# Altium schematic sheet 子图2.SchDoc
size A4
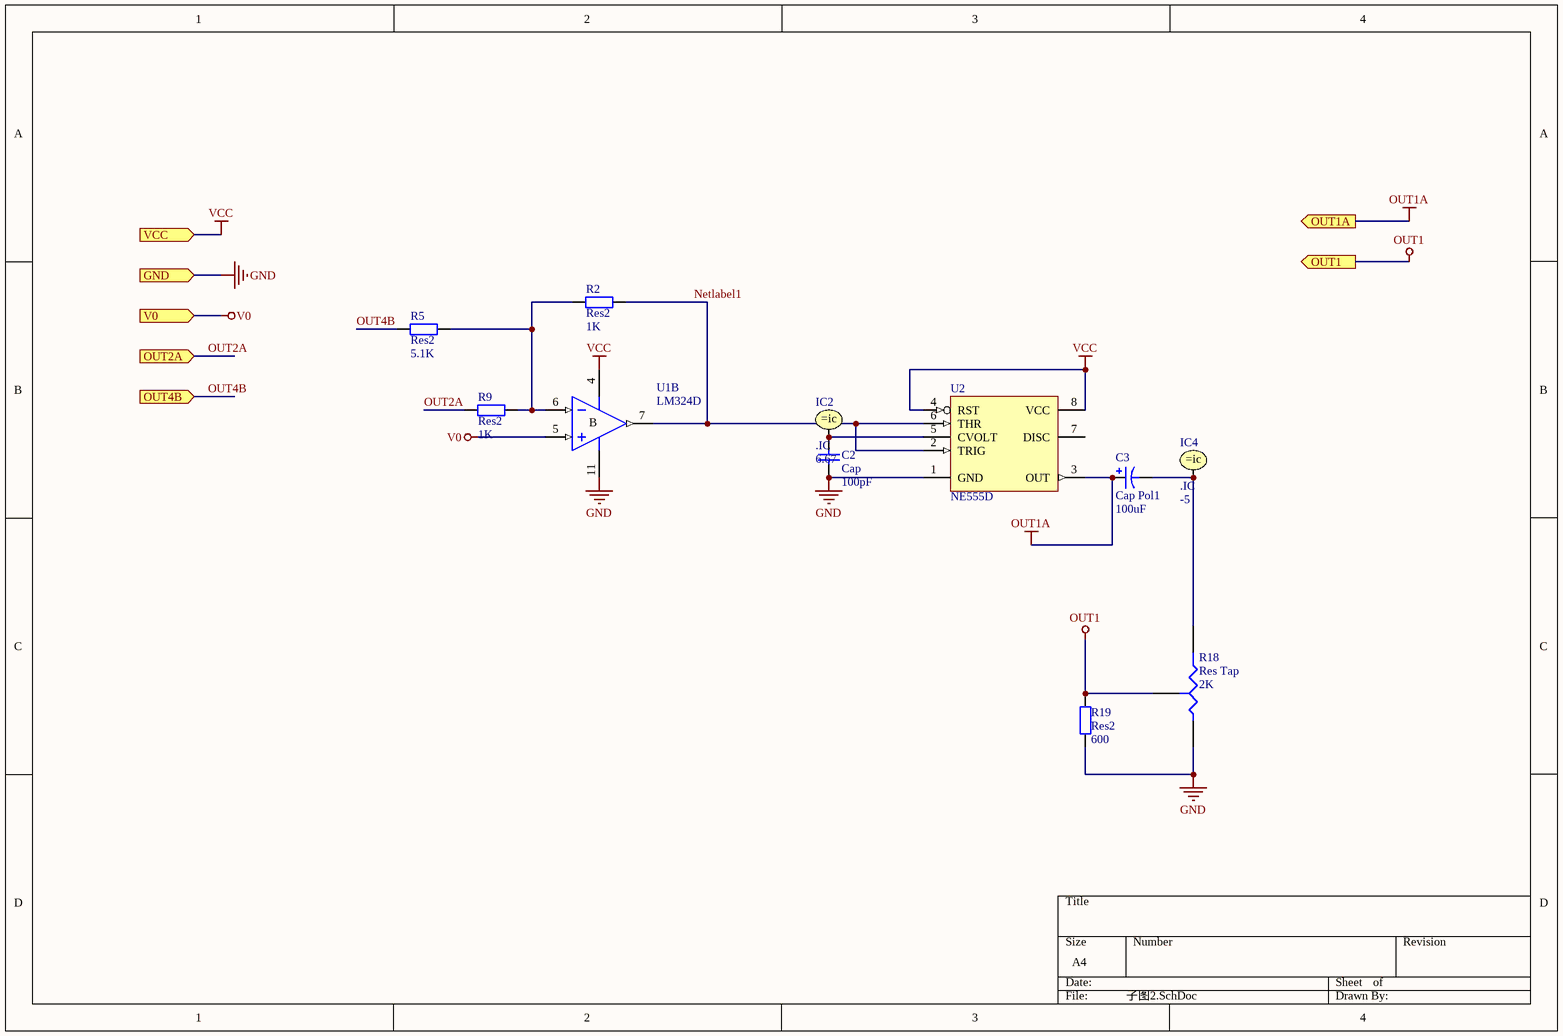
[diagram p0: 子图2.SchDoc]

## Parts
C2  Cap  value 100pF  [LC-0805_C]
C3  Cap Pol1  value 100uF  [LC-CASE-C_6032]
IC2  .IC  Initial Voltage: 6.67
IC4  .IC  Initial Voltage: -5
R2  Res2  value 1K  [LC-0805_R]
R5  Res2  value 5.1K  [LC-0805_R]
R9  Res2  value 1K  [LC-0805_R]
R18  Res Tap  value 2K  [电位器]
R19  Res2  value 600  [LC-0805_R]
U1  LM324D  [SO14_N]  (part B of 4)
U2  NE555D  [D008_N]

## Ports
GND (in), OUT1 (out), OUT1A (out), OUT2A (in), OUT4B (in), V0 (in), VCC (in)

## Nets
GND: C2.1 R18.1(A) R19.1 U1.11(V-) U2.1(GND) ; port GND
OUT1: R18.3(TAP) R19.2 ; port OUT1
OUT1A: C3.1 U2.3(OUT) ; port OUT1A
V0: U1.5(IN+) ; port V0
VCC: U1.4(V+) U2.4(RST) U2.8(VCC) ; port VCC
Netlabel1: R2.2 U1.7(OUT) U2.2(TRIG) U2.6(THR)
OUT2A: R9.1 ; port OUT2A
OUT4B: R5.1 ; port OUT4B
NetC2_2: C2.2 IC2.1 U2.5(CVOLT)
NetC3_2: C3.2 IC4.1 R18.2(B)
NetR2_1: R2.1 R5.2 R9.2 U1.6(IN-)

Not connected (* = marked no-connect by the designer): U2 7(DISC)

## Notes on the sheet
- (in symbol LM324D, part B) B

## Library data of the parts
C2 = Cap: Capacitor; Published: 8-Jun-2000; LatestRevisionDate: 17-Jul-2002; LatestRevisionNote: Re-released for DXP Platform.; PackageReference: RAD-0.3; Publisher: Altium Limited
C3 = Cap Pol1: Polarized Capacitor (Radial); Published: 8-Jun-2000; LatestRevisionDate: 17-Jul-2002; LatestRevisionNote: Re-released for DXP Platform.; PackageReference: RB7.6-15; Publisher: Altium Limited
IC2 IC4 = .IC: Initial Condition; Published: 8-Jun-2000; LatestRevisionDate: 17-Jul-2002; LatestRevisionNote: Re-released for DXP Platform.; PackageReference: Not Applicable; Publisher: Altium Limited
R2 R5 R9 R19 = Res2: Resistor; Published: 8-Jun-2000; LatestRevisionDate: 17-Jul-2002; LatestRevisionNote: Re-released for DXP Platform.; PackageReference: AXIAL-0.4; Publisher: Altium Limited
R18 = Res Tap: Tapped Resistor; Sim Note: Enter the Resistance value and the set point into parameter fields.; Set Position: 0.15; Published: 24-Mar-1999; LatestRevisionDate: 17-Jul-2002; LatestRevisionNote: Re-released for DXP Platform.; PackageReference: VR3; Publisher: Altium Limited
U1 = LM324D: Low-Power Quad Operational Amplifier; Published: 24-Aug-2001; LatestRevisionDate: 13-Apr-2006; LatestRevisionNote: IPC-7351 Footprint Added.; DatasheetVersion: Jun-1999; PackageVersion: Sep-1998; PackageReference: SO14; Publisher: Altium Limited; PackageDescription: 14-Pin Small Outline Integrated Circuit 1.27 mm Pitch; Code_IPC: SOIC127P600-14; ComponentLink1Description: Manufacturer Link; ComponentLink1URL: http://www.st.com/; ComponentLink2Description: Datasheet; ComponentLink2URL: http://www.st.com/stonline/products/literature/ds/2156/lm324.pdf
U2 = NE555D: Precision Timer; Published: 16-Jan-2001; LatestRevisionDate: 13-Apr-2006; LatestRevisionNote: IPC-7351 Footprint Added.; DatasheetVersion: Feb-1992; PackageVersion: Jan-1998; PackageReference: D008; Publisher: Altium Limited; PackageDescription: 8-Pin Small Outline Integrated Circuit 1.27 mm Pitch; Code_IPC: SOIC127P600-8; ComponentLink1Description: Manufacturer Link; ComponentLink1URL: http://www.ti.com/; ComponentLink2Description: Datasheet; ComponentLink2URL: http://www-s.ti.com/sc/ds/ne555.pdf